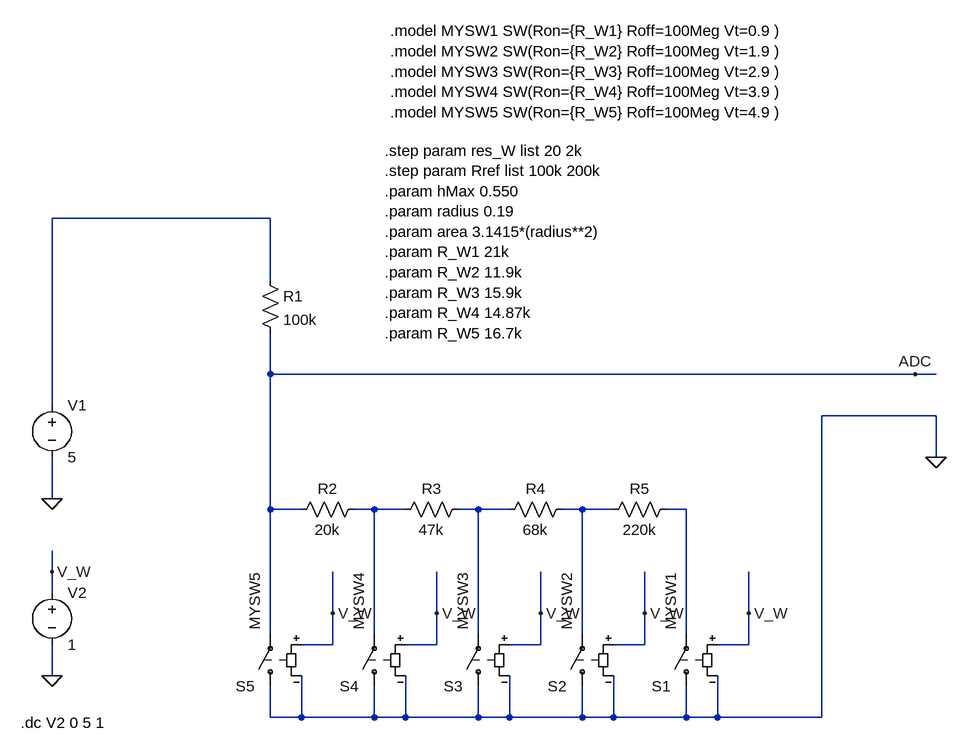
[diagram p0: schematic water_sensor_2.asc]
water_sensor_2.asc, the LTspice schematic file:
Version 4
SHEET 1 1060 916
WIRE 16 48 -320 48
WIRE 16 144 16 48
WIRE 16 288 16 224
WIRE 1008 288 16 288
WIRE 1040 288 1008 288
WIRE -320 336 -320 48
WIRE 1040 352 864 352
WIRE 1040 416 1040 352
WIRE -320 480 -320 416
WIRE 16 496 16 288
WIRE 64 496 16 496
WIRE 176 496 144 496
WIRE 224 496 176 496
WIRE 336 496 304 496
WIRE 384 496 336 496
WIRE 496 496 464 496
WIRE 544 496 496 496
WIRE 656 496 624 496
WIRE -320 592 -320 560
WIRE -320 624 -320 592
WIRE 112 656 112 592
WIRE 272 656 272 592
WIRE 432 656 432 592
WIRE 592 656 592 592
WIRE 752 656 752 592
WIRE 16 688 16 496
WIRE 176 688 176 496
WIRE 336 688 336 496
WIRE 496 688 496 496
WIRE 656 688 656 496
WIRE 112 704 112 656
WIRE 112 704 64 704
WIRE 272 704 272 656
WIRE 272 704 224 704
WIRE 432 704 432 656
WIRE 432 704 384 704
WIRE 592 704 592 656
WIRE 592 704 544 704
WIRE 752 704 752 656
WIRE 752 704 704 704
WIRE -320 752 -320 704
WIRE 16 816 16 768
WIRE 64 816 64 752
WIRE 64 816 16 816
WIRE 176 816 176 768
WIRE 176 816 64 816
WIRE 224 816 224 752
WIRE 224 816 176 816
WIRE 336 816 336 768
WIRE 336 816 224 816
WIRE 384 816 384 752
WIRE 384 816 336 816
WIRE 496 816 496 768
WIRE 496 816 384 816
WIRE 544 816 544 752
WIRE 544 816 496 816
WIRE 656 816 656 768
WIRE 656 816 544 816
WIRE 704 816 704 752
WIRE 704 816 656 816
WIRE 864 816 864 352
WIRE 864 816 704 816
FLAG -320 480 0
FLAG 1008 288 ADC
FLAG 1040 416 0
FLAG 752 656 V_W
FLAG 592 656 V_W
FLAG 432 656 V_W
FLAG 272 656 V_W
FLAG 112 656 V_W
FLAG -320 752 0
FLAG -320 592 V_W
SYMBOL voltage -320 320 R0
WINDOW 123 0 0 Left 0
WINDOW 39 0 0 Left 0
SYMATTR InstName V1
SYMATTR Value 5
SYMBOL res 0 128 R0
SYMATTR InstName R1
SYMATTR Value 100k
SYMBOL res 48 512 R270
WINDOW 0 32 56 VTop 2
WINDOW 3 0 56 VBottom 2
SYMATTR InstName R2
SYMATTR Value 20k
SYMBOL res 208 512 R270
WINDOW 0 32 56 VTop 2
WINDOW 3 0 56 VBottom 2
SYMATTR InstName R3
SYMATTR Value 47k
SYMBOL res 368 512 R270
WINDOW 0 32 56 VTop 2
WINDOW 3 0 56 VBottom 2
SYMATTR InstName R4
SYMATTR Value 68k
SYMBOL res 528 512 R270
WINDOW 0 32 56 VTop 2
WINDOW 3 0 56 VBottom 2
SYMATTR InstName R5
SYMATTR Value 220k
SYMBOL sw 656 784 R180
WINDOW 3 24 103 VRight 2
SYMATTR Value MYSW1
SYMATTR InstName S1
SYMBOL sw 496 784 R180
WINDOW 3 24 103 VRight 2
SYMATTR Value MYSW2
SYMATTR InstName S2
SYMBOL sw 336 784 R180
WINDOW 3 24 103 VRight 2
SYMATTR Value MYSW3
SYMATTR InstName S3
SYMBOL sw 176 784 R180
WINDOW 3 24 103 VRight 2
SYMATTR Value MYSW4
SYMATTR InstName S4
SYMBOL sw 16 784 R180
WINDOW 3 24 103 VRight 2
SYMATTR Value MYSW5
SYMATTR InstName S5
SYMBOL voltage -320 608 R0
WINDOW 123 0 0 Left 0
WINDOW 39 0 0 Left 0
SYMATTR InstName V2
SYMATTR Value 1
TEXT 200 -240 Left 2 !.model MYSW1 SW(Ron={R_W1} Roff=100Meg Vt=0.9 )\n.model MYSW2 SW(Ron={R_W2} Roff=100Meg Vt=1.9 )\n.model MYSW3 SW(Ron={R_W3} Roff=100Meg Vt=2.9 )\n.model MYSW4 SW(Ron={R_W4} Roff=100Meg Vt=3.9 )\n.model MYSW5 SW(Ron={R_W5} Roff=100Meg Vt=4.9 )
TEXT 192 -56 Left 2 !.step param res_W list 20 2k\n.step param Rref list 100k 200k\n.param hMax 0.550\n.param radius 0.19\n.param area 3.1415*(radius**2)\n.param R_W1 21k\n.param R_W2 11.9k\n.param R_W3 15.9k\n.param R_W4 14.87k\n.param R_W5 16.7k
TEXT -368 824 Left 2 !.dc V2 0 5 1

The netlist it stands for:
* water_sensor_2.asc
V1 N001 0 5
R1 N001 ADC 100k
R2 ADC N002 20k
R3 N002 N003 47k
R4 N003 N004 68k
R5 N004 N005 220k
S1 0 N005 V_W 0 MYSW1
S2 0 N004 V_W 0 MYSW2
S3 0 N003 V_W 0 MYSW3
S4 0 N002 V_W 0 MYSW4
S5 0 ADC V_W 0 MYSW5
V2 V_W 0 1
.model MYSW1 SW(Ron={R_W1} Roff=100Meg Vt=0.9 )
.model MYSW2 SW(Ron={R_W2} Roff=100Meg Vt=1.9 )
.model MYSW3 SW(Ron={R_W3} Roff=100Meg Vt=2.9 )
.model MYSW4 SW(Ron={R_W4} Roff=100Meg Vt=3.9 )
.model MYSW5 SW(Ron={R_W5} Roff=100Meg Vt=4.9 )
.step param res_W list 20 2k
.step param Rref list 100k 200k
.param hMax 0.550
.param radius 0.19
.param area 3.1415*(radius**2)
.param R_W1 21k
.param R_W2 11.9k
.param R_W3 15.9k
.param R_W4 14.87k
.param R_W5 16.7k
.dc V2 0 5 1
.backanno
.end